# EAGLE design esp (EAGLE 9.1.3)
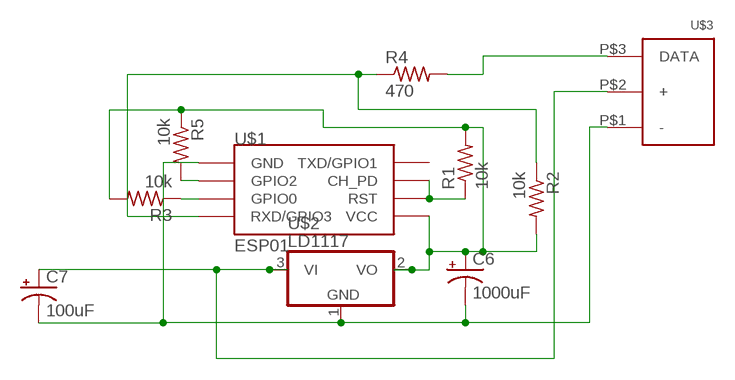
[diagram p0: schematic, sheet 1]

## Parts
C6  1000uF  CPOL-USE5-10.5  [E5-10,5]
C7  100uF  CPOL-USE2.5-6  [E2,5-6]
R1  10k  R-US_0204/7  [0204/7]
R2  10k  R-US_0204/7  [0204/7]
R3  10k  R-US_0204/7  [0204/7]
R4  470  R-US_0204/7  [0204/7]
R5  10k  R-US_0204/7  [0204/7]
U$1  ESP01  [ESP01]
U$2  LD1117  [TO220V]
U$3  SERVO  [1X3]

## Nets
N$1: R4.2 U$3.P$3(DATA)
N$2: R3.1 U$1.GPIO0
N$3: C6.- C7.- U$1.GND U$2.1(GND) U$3.P$1(-)
N$5: R1.1 U$1.CH_PD U$1.RST
N$6: C6.+ R1.2 R2.2 R3.2 R5.1 U$1.VCC U$2.2(VO)
N$7: R5.2 U$1.GPIO2
N$9: R2.1 R4.1 U$1.RX(RXD/GPIO3)
N$11: C7.+ U$2.3(VI) U$3.P$2(+)
Unconnected: U$1.TX(TXD/GPIO1)

## Library data of the parts
C6 C7 = adafruit:CPOL-US: POLARIZED CAPACITOR, American symbol
R1-R5 = adafruit:R-US_: RESISTOR, American symbol
U$1 = esp8266modules:ESP01: ESP8266 Wifi module 01
U$2 = adafruit:LD1117
U$3 = aaaacustom:SERVO

## Board
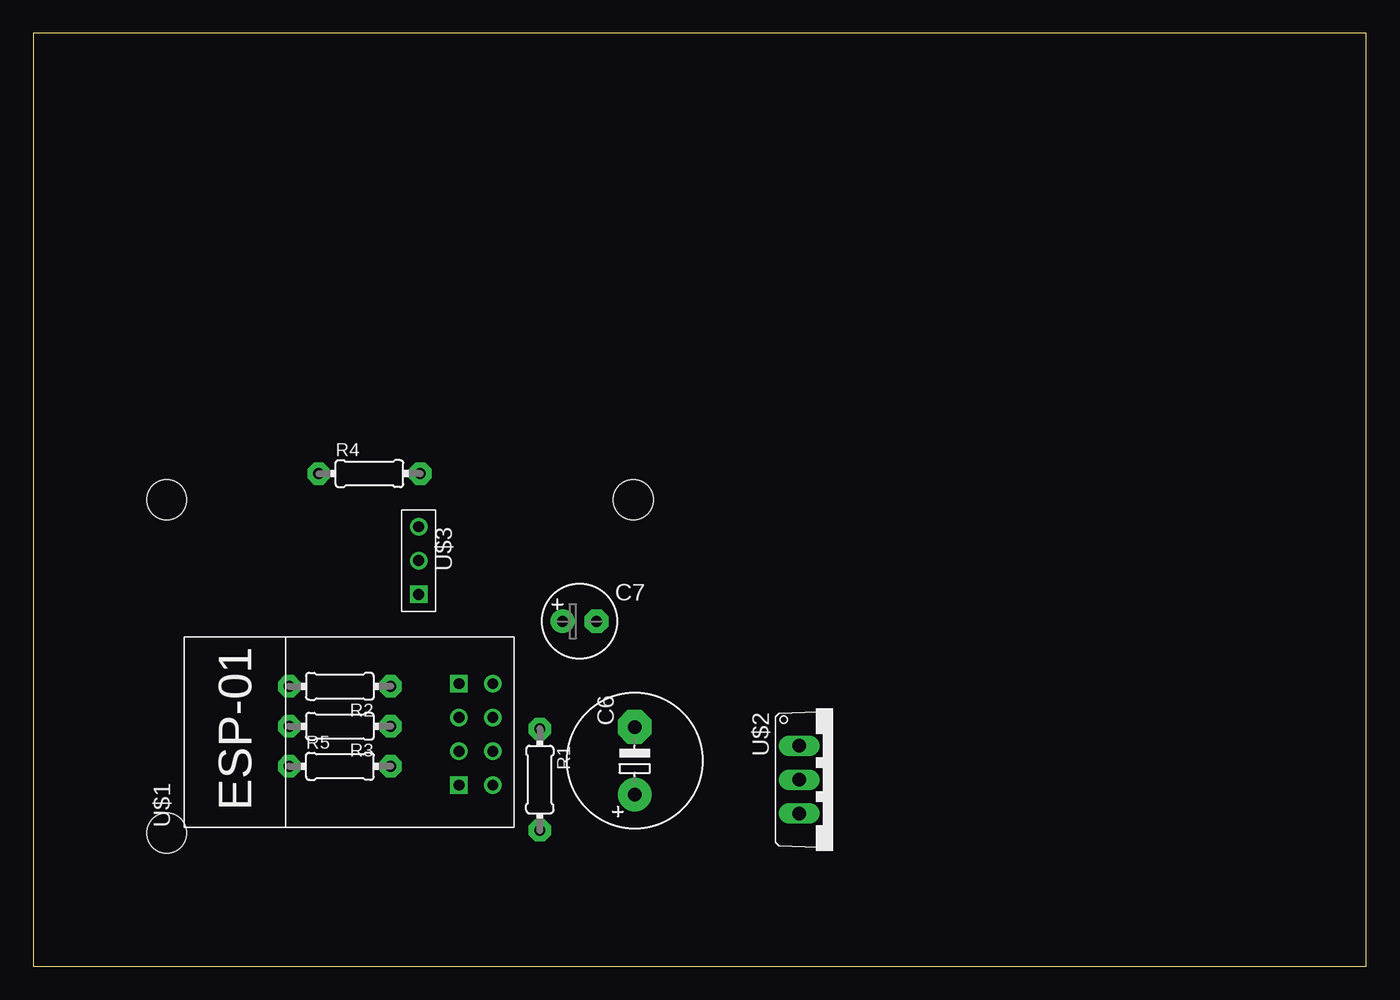
[diagram p1: board, top side]
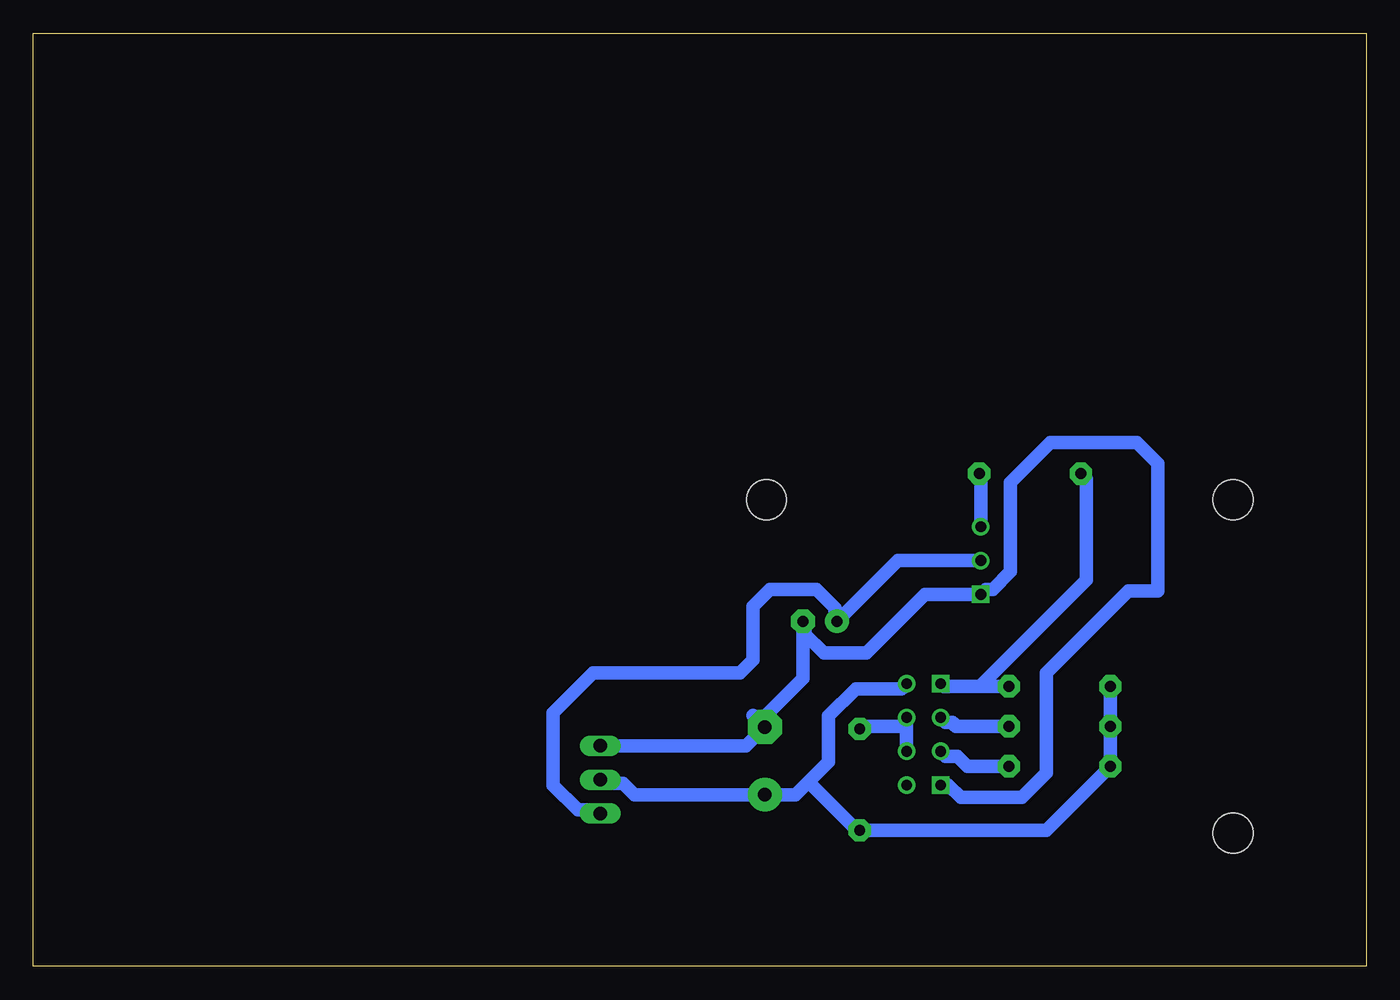
[diagram p2: board, bottom side, seen from below]

Size 100 x 70 mm. Coordinates in mm from the lower left corner, seen from the top.
Outline: 0,0 100,0 100,70 0,70 0,0
Copper layers (1*16): Top 0.035mm / dielectric 1.5mm / Bottom 0.035mm
Design rules "default": minimum track width 1mm, minimum drill 1mm, track to track 1mm, track to pad 1mm, pad to pad 0.5mm, via to via 1mm, smd to smd 6mil, copper to edge 0.5mm, drill to drill 0.5mm, minimum pad ring 10mil, minimum via ring 8mil, stop-mask expansion 4mil, vias tented up to drill 0mil, thermal gap 10mil
Holes 3 mm at 10,35 45,35 10,10

### Footprints (pad centres in the part's own frame; a part is rotated, then mirrored left to right if it is on the bottom)
E5-10,5 = drill 1.016 pad 2.54: + -2.54,0 | drill 1.016 pad 2.54 octagon: - 2.54,0
E2,5-6 = drill 0.813 pad 1.778: + -1.27,0 | drill 0.813 pad 1.778 octagon: - 1.27,0
0204/7 = drill 0.813 pad 1.676 octagon: 1 -3.81,0; 2 3.81,0
ESP01 = drill 0.8: CH_PD -1.285,-8.178; GPIO0 1.255,-5.638; GPIO2 -1.285,-5.638; RST 1.255,-8.178; TX -3.825,-8.178; VCC 3.795,-8.178 | drill 0.8 square: GND -3.825,-5.638; RX 3.795,-5.638
TO220V = drill 1.016 long: 1 -2.54,-2.54; 2 0,-2.54; 3 2.54,-2.54
1X3 = drill 0.8 square: P$1 0,0 | drill 0.8: P$2 0,-2.54; P$3 0,-5.08

### Placement (x,y rotation side)
C6  45.12,15.41 90 top
C7  40.98,25.88 0 top
R1  38,14 270 top
R2  23,21 180 top
R3  23,18 180 top
R4  25.22,36.96 0 top
R5  23,15 0 top
U$1  26.3,17.41 90 top
U$2  60,14 270 top
U$3  28.91,27.9 180 top

### Tracks (layer width: path | path; a pad name or v marks a point on that pad's centre or on a via)
N$1
  Bottom 1: R4.2 28.91,36.84 U$3.P$3
N$2
  Bottom 1: R3.1 30.77,18 31.05,18.28 31.55,18.28 U$1.GPIO0
N$3
  Bottom 1: C6.- 45.12,18.73 42.25,21.6 C7.- 42.1,25.73 42.1,24.89 40.7,23.49 37.51,23.49 33.1,27.9 U$3.P$1 28.52,28.29 28.02,28.29 26.69,29.61 26.69,36.31 23.7,39.3 17.2,39.3 15.62,37.72 15.62,28.16 17.84,28.16 24,22 24,14.5 25.84,12.66 30.41,12.66 31.34,13.59 U$1.GND | C6.- 46,18.83 | U$2.1 46.53,16.54 C6.-
N$5
  Bottom 1: U$1.RST 34.48,18 | 34.48,18 U$1.CH_PD | R1.1 37.81,18 34.48,18
N$6
  Bottom 1: 45.12,12.69 C6.+ | C6.+ 54.91,12.87 55.76,13.72 57.18,13.72 U$2.2 | C6.+ 42.81,12.87 41.84,13.84 | U$1.VCC 34.86,20.82 38.3,20.82 40.34,18.78 40.34,15.34 41.84,13.84 | 41.84,13.84 38.19,10.19 R1.2 24,10.19 R5.1 R3.2 R2.2
N$7
  Bottom 1: R5.2 29.92,15 30.66,15.74 31.55,15.74 U$1.GPIO2
N$9
  Bottom 1: R4.1 21,36.55 21,29 29,21 | 27,21 R2.1 29,21 | 29,21 31.73,21 U$1.RX
N$11
  Bottom 1: U$3.P$2 35.15,30.44 C7.+ 39.86,26.03 39.86,26.87 41.26,28.27 44.73,28.27 46,27 46,23 47,22 58,22 61,19 61,13.58 59.14,11.72 57.72,11.72 U$2.3